# Altium schematic sheet Sheet1.SchDoc
size 457 x 241 mm
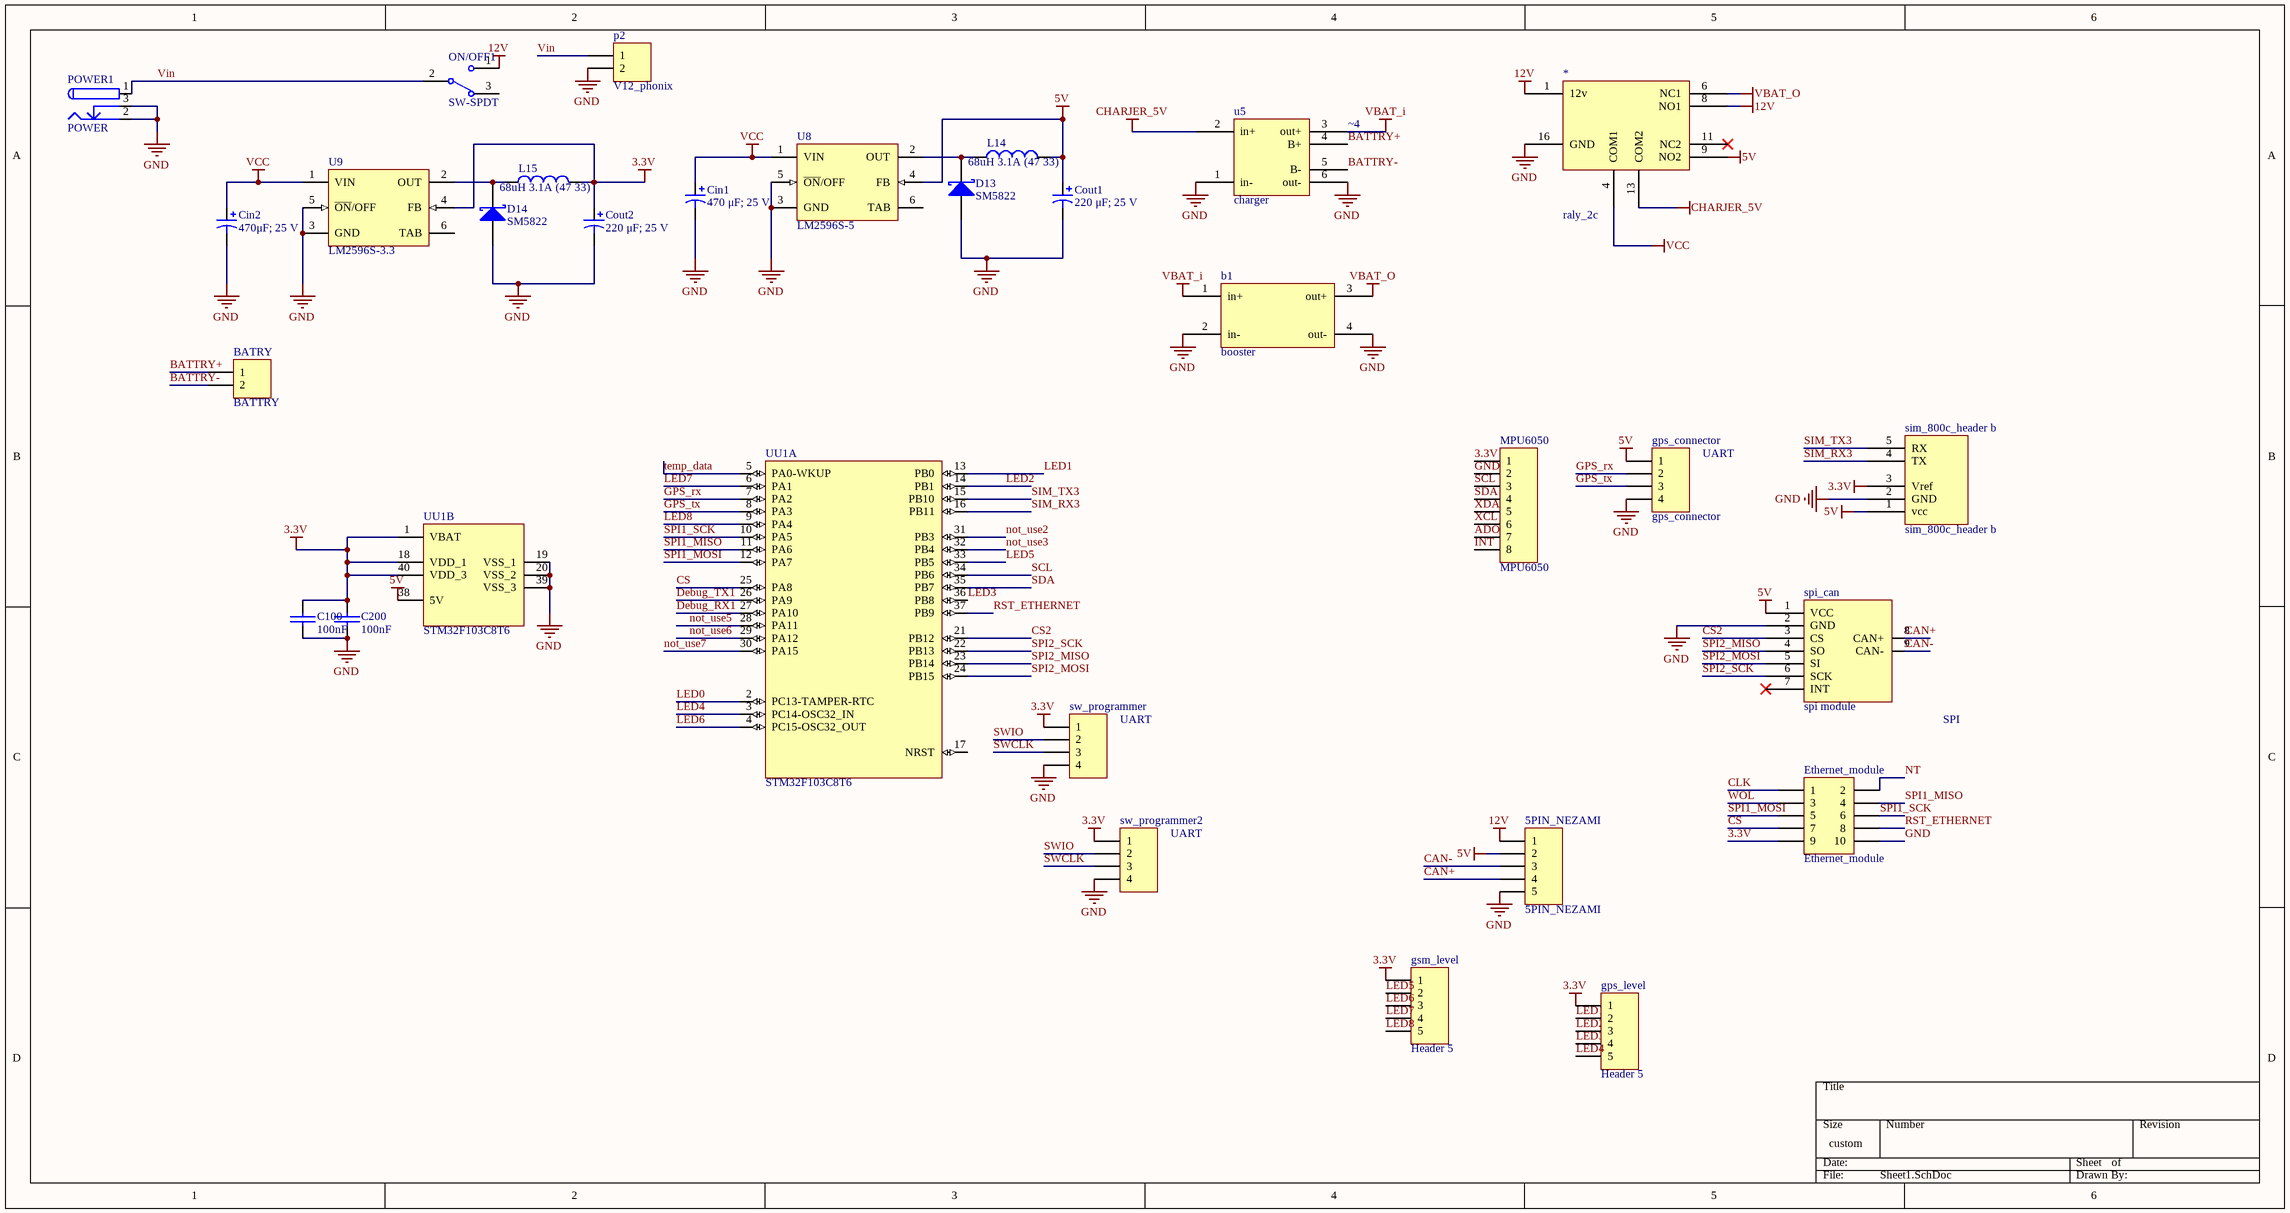
[diagram p0: Sheet1.SchDoc]

## Parts
5PIN_NEZAMI  5PIN_NEZAMI  [5PIN_NEZAMI_CAN]
*  raly_2c  [RELAY12-2c-HJR1-2C]
b1  booster  [booster]
BATRY  BATTRY  [HDR1X2]
C100  100nF  [1206]
C200  100nF  [1206]
Cin1  470 μF; 25 V  [E]
Cin2  470μF; 25 V  [E]
Cout1  220 μF; 25 V  [E]
Cout2  220 μF; 25 V  [E]
D13  SM5822  [SMB]
D14  SM5822  [SMB]
Ethernet_module  Ethernet_module  [ethernet_module]
gps_connector  gps_connector  [GPS_PORT_MODULE]
gps_level  Header 5  [HDR1X5]
gsm_level  Header 5  [HDR1X5]
L14  68uH 3.1A (47 33)  [CAPR5-4X5]
L15  68uH 3.1A (47 33)  [CAPR5-4X5]
MPU6050  MPU6050  [mpu6050]
ON/OFF1  SW-SPDT  [TL36WW15050]
p2  V12_phonix  [phoenix terminal R 2]
POWER1  POWER  [POWERIN]
sim_800c_header_b  sim_800c_header b  [SIM800_MODULE]
spi_can  spi module  [SPI_CAN]
sw_programmer  (no value)  [HDR1X4]
sw_programmer2  (no value)  [HDR1X4]
u5  charger  [CHARGER]
U8  LM2596S-5  [TS5B_N]
U9  LM2596S-3.3  [TS5B_N]
UU1  STM32F103C8T6  [header_board_st_40]  (parts A,B of 2)

## Nets
3.3V: C100.1(+) C200.1(+) Cout2.1 Ethernet_module.9 gps_level.1 gsm_level.1 L15.2 MPU6050.1 sim_800c_header_b.3(Vref) sw_programmer.1 sw_programmer2.1 U9.4(FB) UU1.1(VBAT) UU1.18(VDD_1) UU1.40(VDD_3)
5V: 5PIN_NEZAMI.2 *.9(NO2) Cout1.1 gps_connector.1 L14.2 sim_800c_header_b.1(vcc) spi_can.1(VCC) U8.4(FB) UU1.38(5V)
12V: 5PIN_NEZAMI.1 *.1(12v) *.8(NO1) ON/OFF1.1
CHARJER_5V: *.13(COM2) u5.2(in+)
GND: 5PIN_NEZAMI.5 *.16(GND) b1.2(in-) b1.4(out-) C100.2(-) C200.2(-) Cin1.2 Cin2.2 Cout1.2 Cout2.2 D13.1(A) D14.1(A) Ethernet_module.10 gps_connector.4 MPU6050.2 p2.2 POWER1.2 POWER1.3 sim_800c_header_b.2(GND) spi_can.2(GND) sw_programmer.4 sw_programmer2.4 u5.1(in-) u5.6(out-) U8.3(GND) U8.5(~{ON}/OFF) U9.3(GND) U9.5(~{ON}/OFF) UU1.19(VSS_1) UU1.20(VSS_2) UU1.39(VSS_3)
VBAT_i: b1.1(in+) u5.3(out+)
VBAT_O: *.6(NC1) b1.3(out+)
VCC: *.4(COM1) Cin1.1 Cin2.1 U8.1(VIN) U9.1(VIN)
ADO: MPU6050.7
BATTRY+: BATRY.1 u5.4(B+)
BATTRY-: BATRY.2 u5.5(B-)
CAN+: 5PIN_NEZAMI.4 spi_can.8(CAN+)
CAN-: 5PIN_NEZAMI.3 spi_can.9(CAN-)
CLK: Ethernet_module.1
CS: Ethernet_module.7 UU1.25(PA8)
CS2: spi_can.3(CS) UU1.21(PB12)
Debug_RX1: UU1.27(PA10)
Debug_TX1: UU1.26(PA9)
GPS_rx: gps_connector.2 UU1.7(PA2)
GPS_tx: gps_connector.3 UU1.8(PA3)
INT: MPU6050.8
LED0: UU1.2(PC13-TAMPER-RTC)
LED1: gps_level.2 UU1.13(PB0)
LED2: gps_level.3 UU1.14(PB1)
LED3: gps_level.4 UU1.36(PB8)
LED4: gps_level.5 UU1.3(PC14-OSC32_IN)
LED5: gsm_level.2 UU1.33(PB5)
LED6: gsm_level.3 UU1.4(PC15-OSC32_OUT)
LED7: gsm_level.4 UU1.6(PA1)
LED8: gsm_level.5 UU1.9(PA4)
not_use2: UU1.31(PB3)
not_use3: UU1.32(PB4)
not_use5: UU1.28(PA11)
not_use6: UU1.29(PA12)
not_use7: UU1.30(PA15)
NT: Ethernet_module.2
RST_ETHERNET: Ethernet_module.8 UU1.37(PB9)
SCL: MPU6050.3 UU1.34(PB6)
SDA: MPU6050.4 UU1.35(PB7)
SIM_RX3: sim_800c_header_b.4(TX) UU1.16(PB11)
SIM_TX3: sim_800c_header_b.5(RX) UU1.15(PB10)
SPI1_MISO: Ethernet_module.4 UU1.11(PA6)
SPI1_MOSI: Ethernet_module.5 UU1.12(PA7)
SPI1_SCK: Ethernet_module.6 UU1.10(PA5)
SPI2_MISO: spi_can.4(SO) UU1.23(PB14)
SPI2_MOSI: spi_can.5(SI) UU1.24(PB15)
SPI2_SCK: spi_can.6(SCK) UU1.22(PB13)
SWCLK: sw_programmer.3 sw_programmer2.3
SWIO: sw_programmer.2 sw_programmer2.2
temp_data: UU1.5(PA0-WKUP)
Vin: ON/OFF1.2 p2.1 POWER1.1
WOL: Ethernet_module.3
XCL: MPU6050.6
XDA: MPU6050.5
NetD13_2: D13.2(K) L14.1 U8.2(OUT)
NetD14_2: D14.2(K) L15.1 U9.2(OUT)

Not connected (* = marked no-connect by the designer): * 11(NC2)*; ON/OFF1 3; POWER1 1A 1B 2A 2B 3A 3B; spi_can 7(INT)*; U8 6(TAB); U9 6(TAB); UU1 17(NRST)

## Notes on the sheet
- (near u5) ~4
- UART
- SPI

## Library data of the parts
5PIN_NEZAMI = 5PIN_NEZAMI: Header, 8-Pin; LatestRevisionDate: 17-Jul-2002; LatestRevisionNote: Re-released for DXP Platform.; Publisher: Altium Limited
BATRY p2 = Header 2: Header, 2-Pin; LatestRevisionDate: 17-Jul-2002; LatestRevisionNote: Re-released for DXP Platform.; Publisher: Altium Limited
C100 C200 = Cap-Bipolar: Bipolar Capacitor; Voltage: 100V; Designer: Saeid Jorablo; Organazation: ControTec; Adding Date: 1387/12/20; Value: 100nF
Cin1 Cin2 Cout1 Cout2 = 94SH107X0016EBP: Solid Aluminum Capacitor with Organic Semiconductor Electrolyte: 100uF, 16V, Bulk Pack; Note: Part Numbers shown are for ± 20% capacitance tolerance (X0).; PCB_Layout: Complies with Manufacturer's Recommendation.; DrillSize: Nominal, Rounded to the nearest 0.1mm; Published: 19-Mar-2004; DatasheetDocument: 23-May-2001; PackageReference: E; Publisher: Altium Limited; ComponentLink1Description: Manufacturer Link; ComponentLink1URL: http://www.vishay.com/; ComponentLink2Description: Datasheet; ComponentLink2URL: http://www.vishay.com/docs/90006/94sh.pdf; Value: 100uF
D13 D14 = D Schottky: Schottky Diode; Published: 8-Jun-2000; LatestRevisionDate: 17-Jul-2002; LatestRevisionNote: Re-released for DXP Platform.; PackageReference: SMB; Publisher: Altium Limited; PackageDescription: DO-214-AA/SMB; 2 C-Bend Leads; Body 5.3 x 3.6 mm, inc. leads (LxW); Code_JEDEC: DO-214-AA
Ethernet_module = Header 5X2: Header, 5-Pin, Dual row; LatestRevisionDate: 17-Jul-2002; LatestRevisionNote: Re-released for DXP Platform.; Publisher: Altium Limited
gps_connector sw_programmer sw_programmer2 = Header 4: Header, 4-Pin; LatestRevisionDate: 17-Jul-2002; LatestRevisionNote: Re-released for DXP Platform.; Publisher: Altium Limited
gps_level gsm_level = Header 5: Header, 5-Pin; LatestRevisionDate: 17-Jul-2002; LatestRevisionNote: Re-released for DXP Platform.; Publisher: Altium Limited
L14 L15 = Inductor: Code_IEC: 1005; Value: 10mH; Published: 8-Jun-2000; LatestRevisionDate: 29-May-2009; LatestRevisionNote: IPC-7351 Footprint Added.; PackageReference: 0402-A; Publisher: Altium Limited; PackageDescription: Chip Inductor; Code_JEITA: 0402
MPU6050 = Header 8: Header, 8-Pin; LatestRevisionDate: 17-Jul-2002; LatestRevisionNote: Re-released for DXP Platform.; Publisher: Altium Limited
ON/OFF1 = SW-SPDT: SPDT Subminiature Toggle Switch, Right Angle Mounting, Vertical Actuation; Published: 24-Mar-1999; LatestRevisionDate: 17-Dec-2003; LatestRevisionNote: Schematic revised, PCB Footprint replaced.; DatasheetVersion: 05-Dec-2000; PackageReference: TL36WW15050; Publisher: Altium Limited; PackageDescription: Switch; 4 Leads; ComponentLink1Description: Manufacturer Link; ComponentLink1URL: http://www.apem.com
POWER1 = PWR2.5: Low Voltage Power Supply Connector; Published: 17-Dec-2003; DatasheetDocument: 09-May-2002; Publisher: Altium Limited; ComponentLink1Description: Manufacturer Link; ComponentLink1URL: http://domino.kycon.com/internet/Products.html
u5 = 03962A
U8 U9 = LM2596S-ADJ: SIMPLE SWITCHER® Power Converter 150 KHz 3A Step-Down Voltage Regulator, 5-pin TO-263; Manufacturer: National Semiconductor; PackageTopMarking: NSUZXYTTE#*LM2596S*-ADJ P+; PowerWise: N; Published: 4-Dec-2008; DatasheetVersion: May-2002; PackageVersion: revD, Apr-2005; PackageReference: TS5B; Publisher: Altium Limited; PackageDescription: TO-263, Molded, .400 x .390 x .180in, 5 Lead, .067in Pitch, Surface Mount; Supplier 1: Farnell; Supplier Part Number 1: 1523864; Supplier 2: Farnell; Supplier Part Number 2: 9494367; PartNumber: LM2596S-ADJ; RoHS: N; PinCount: 5; CompType: Switcher; Code_JEDEC: MO-169-AB; ComponentLink1Description: LM2596 Datasheet; ComponentLink1URL: http://www.national.com/ds/LM/LM2596.pdf; ComponentLink2Description: LM2596 Web Page; ComponentLink2URL: http://www.national.com/pf/LM/LM2596.html; ComponentLink3Description: TS5B Package Page; ComponentLink3URL: http://www.national.com/packaging/folders/ts5b.html
UU1 = STM32F103C8T6: ARM Cortex-M3 32-bit MCU, 64 KB Flash, 20 KB Internal RAM, 37 I/Os, 48-pin LQFP, -40 to 85 degC, Tray; A/D Converter: 2x12-bit (10 Channel); FLASH Size (Prog) (kB): 64; I/Os (High Current): 37; Internal RAM Size (kB): 20; Operating Frequency(F) (Processor speed) (MHz): 72; Supply Voltage(Vcc) min (V): 2; DatasheetVersion: Rev. 16; PackageVersion: Rev. 6, 06/2013; PackageReference: LQFP48; PackageDescription: 48-Pin Low Profile Quad Flat Package, 7 x 7 mm Body, 0.5 mm Pitch; Supplier 1: Digi-Key; Supplier Part Number 1: 497-6063-ND; Supplier 2: Farnell; Supplier Part Number 2: 1447637; Supplier 3: Newark; Supplier Part Number 3: 59M2182; Supplier 4: Newark; Supplier Part Number 4: 57P1222; Supplier 5: Mouser; Supplier Part Number 5: 511-STM32F103C8T6; Core: ARM Cortex-M3; Packing: Tray; Mounting Technology: Surface Mount; PartNumber: STM32F103C8T6; ComponentLink1Description: Manufacturer URL; ComponentLink1URL: http://www.st.com/web/en/home.html; ComponentLink2Description: Datasheet; ComponentLink2URL: http://www.st.com/st-web-ui/static/active/en/resource/technical/document/datasheet/CD00161566.pdf; ComponentLink3Description: Package Specification; ComponentLink3URL: http://www.st.com/st-web-ui/static/active/en/resource/technical/document/datasheet/DM00058181.pdf